# EAGLE schematic CosmicPiuTelescopeAlpha (EAGLE 8.3.1)

## Sheet 1 of 2
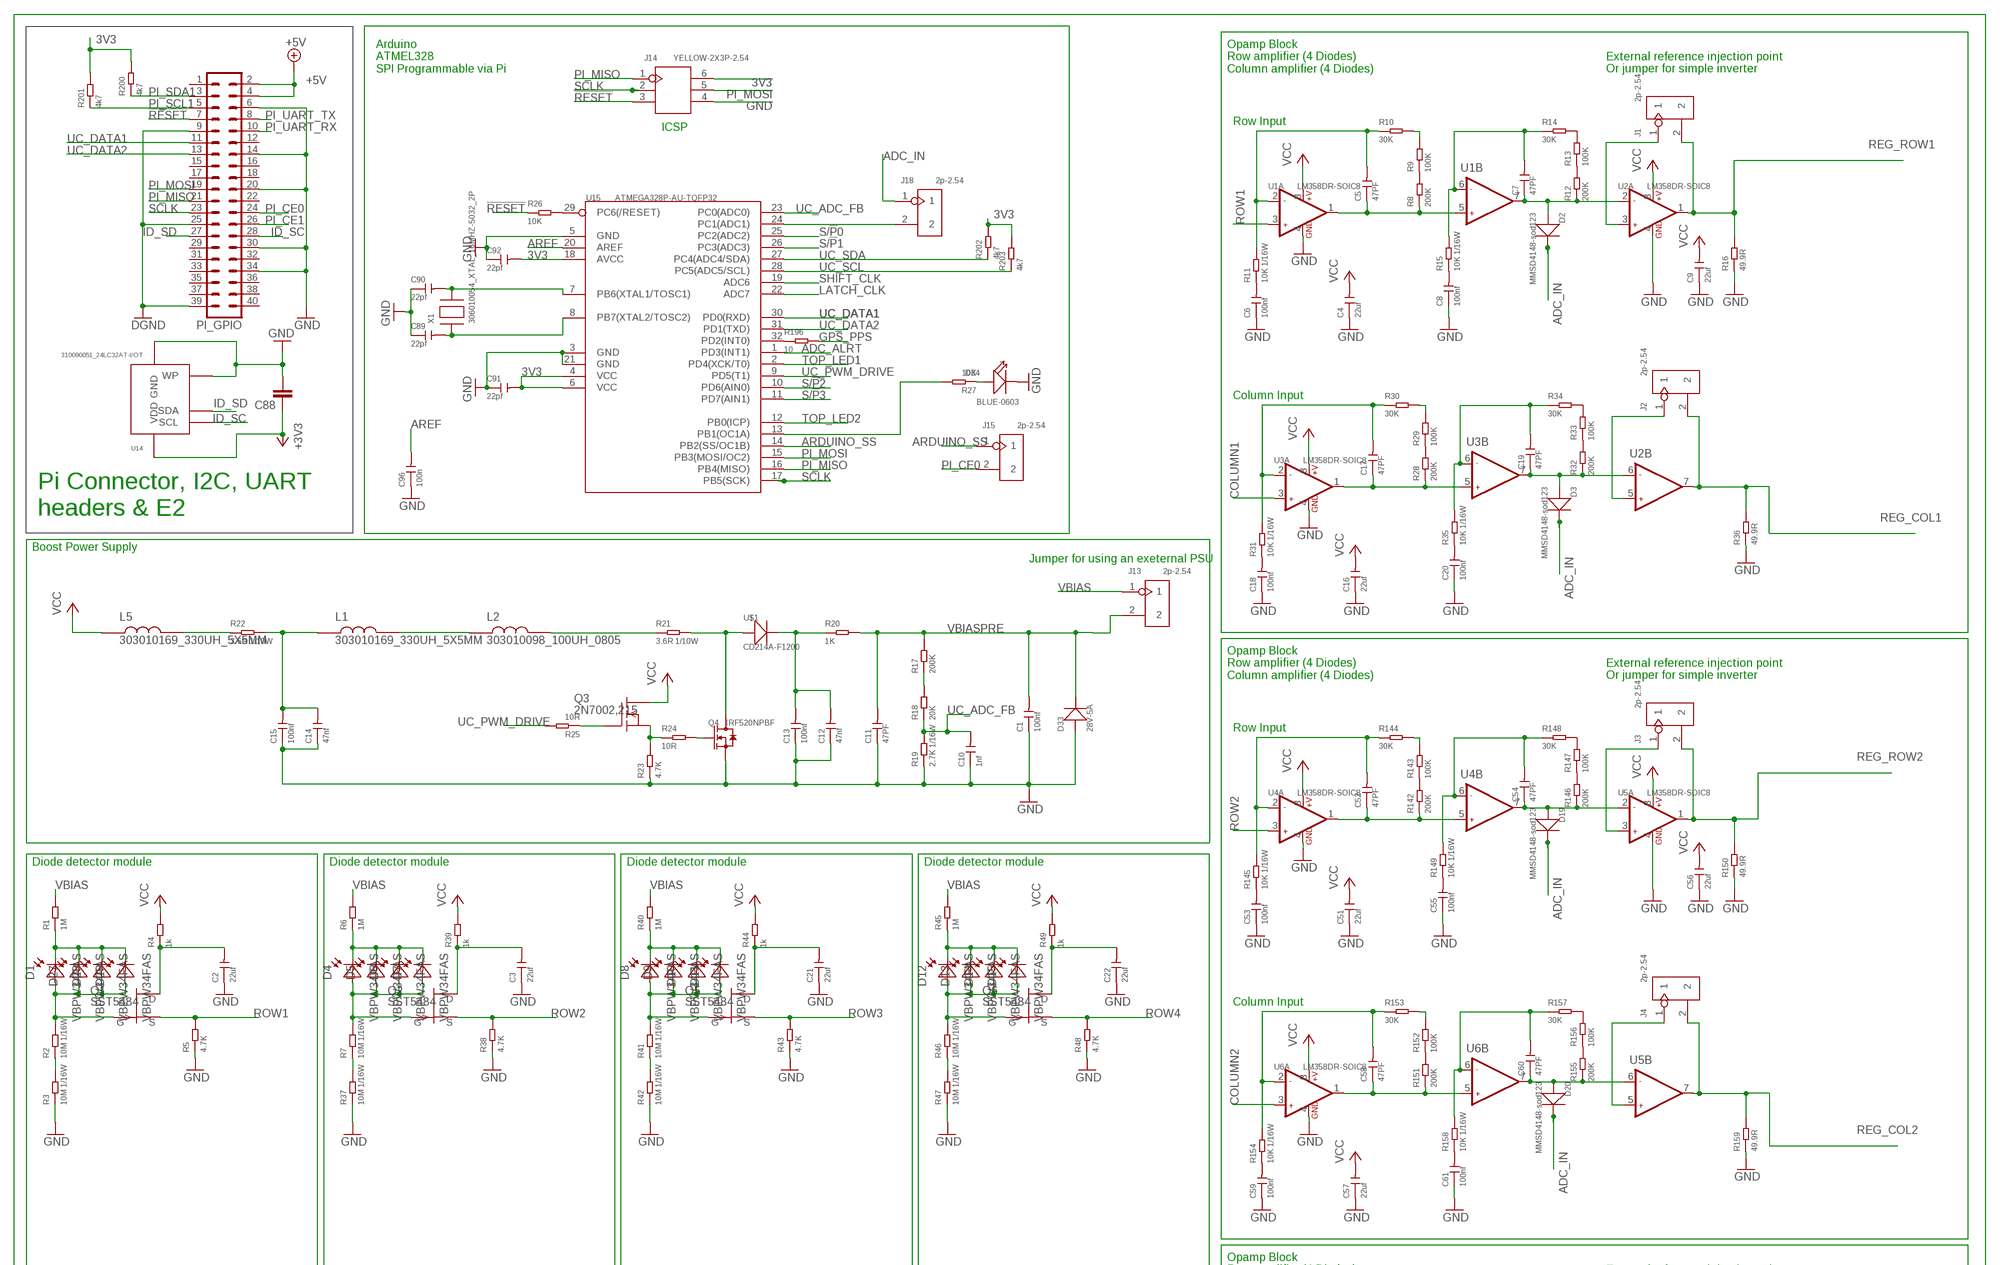
[diagram p0: schematic, sheet 1, part 1 of 2]
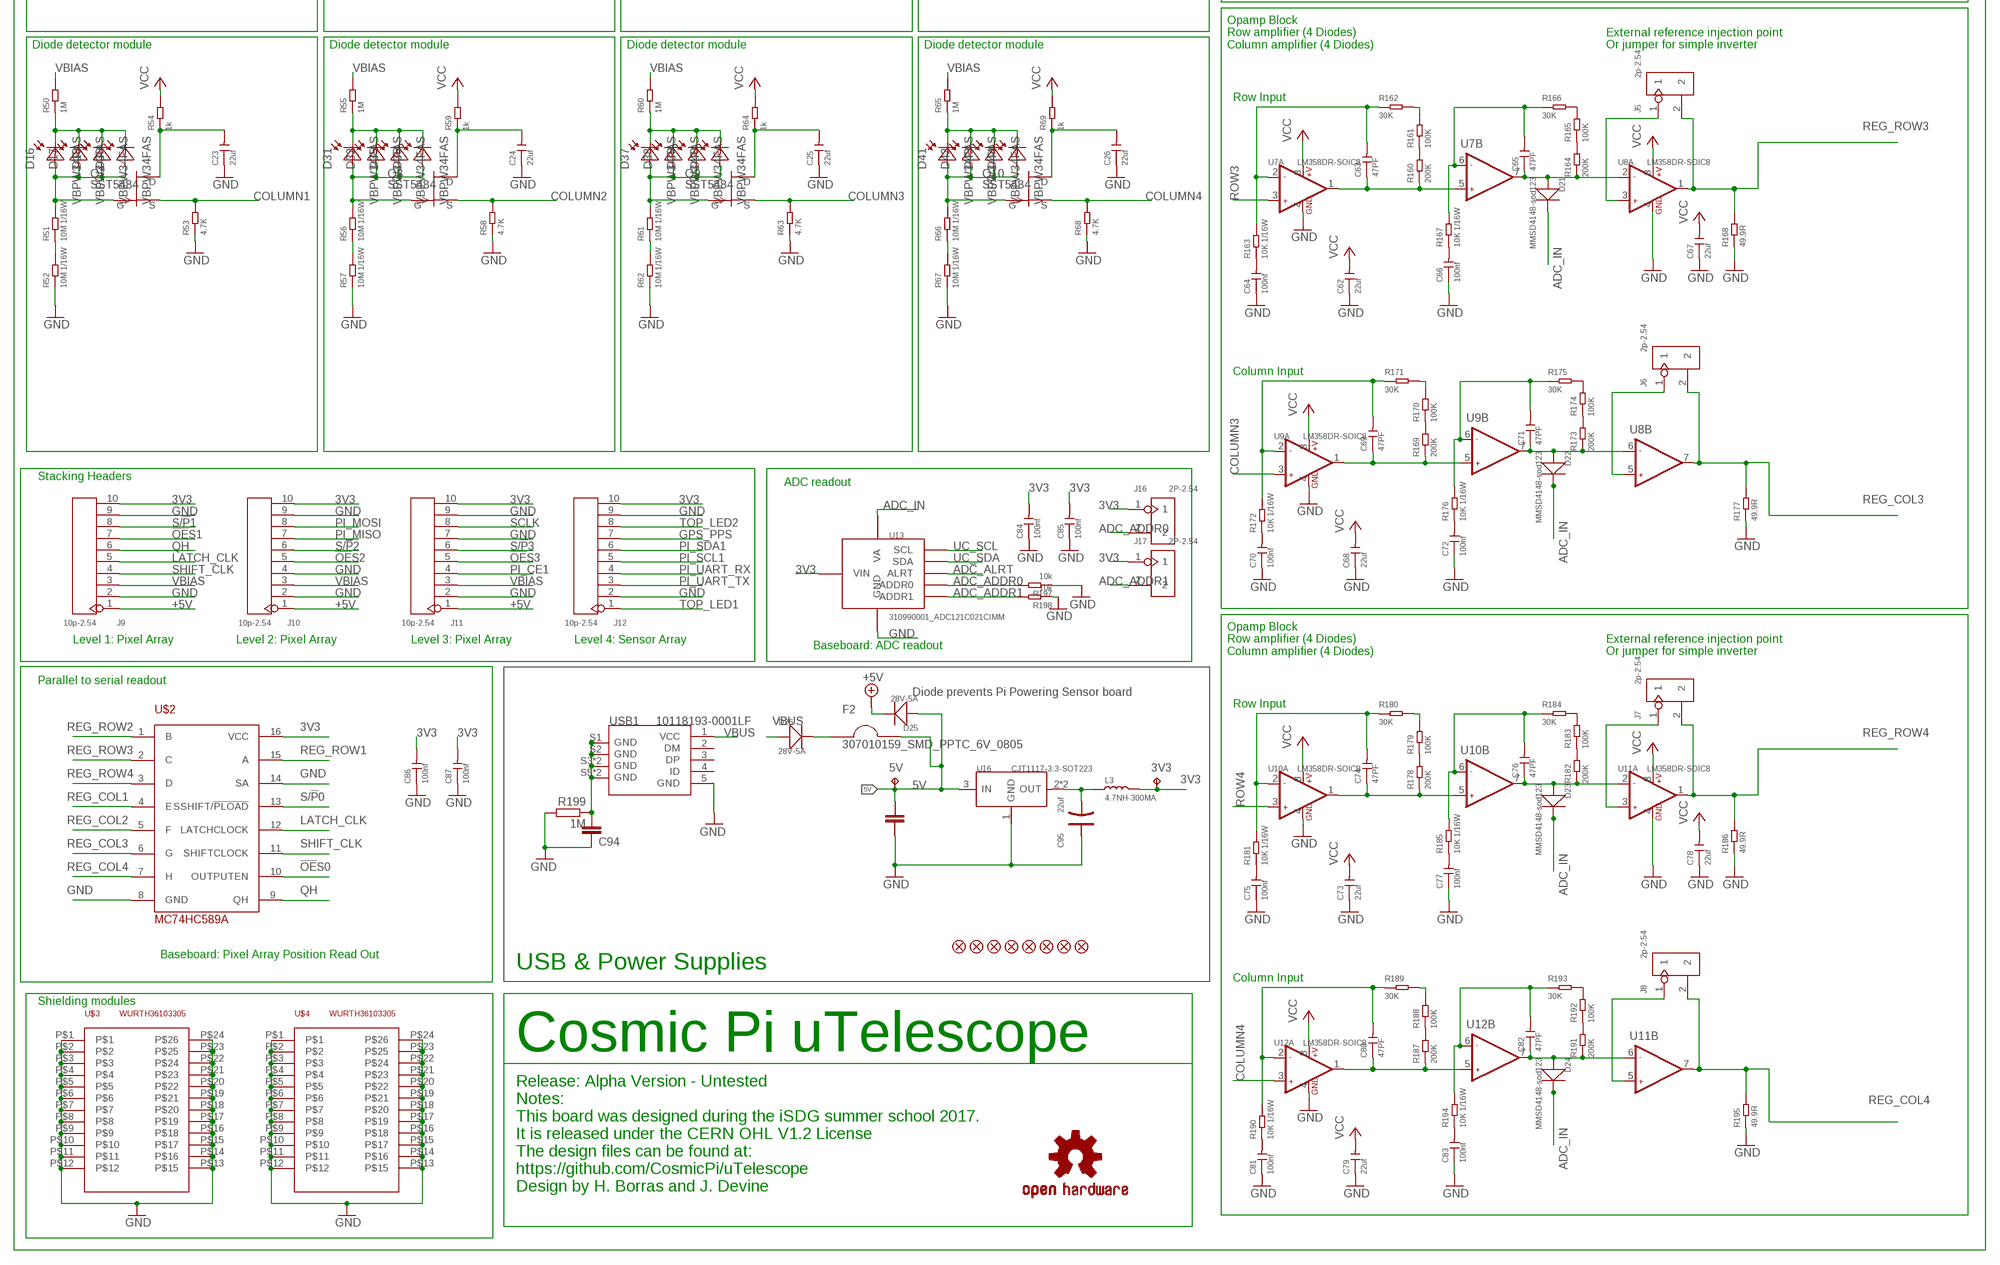
[diagram p1: schematic, sheet 1, part 2 of 2]

### Parts
3V3  TPB1,27  [B1,27]
5V  TPB1,27  [B1,27]
C1  100nf  CERAMIC-100NF-50V-10%-X7R(0603)  [C0603]
C2  22uf  CERAMIC-100UF-6.3V-20%-X5R(1206)  [C1206]
C3  22uf  CERAMIC-100UF-6.3V-20%-X5R(1206)  [C1206]
C4  22uf  CERAMIC-22UF-6.3V-20%-X5R(0805)  [C0805]
C5  47PF  CERAMIC-47PF-50V-5%-NP0(0402)  [C0402]
C6  100nf  CERAMIC-100NF-25V-10%-X7R(0402)  [C0402]
C7  47PF  CERAMIC-47PF-50V-5%-NP0(0402)  [C0402]
C8  100nf  CERAMIC-100NF-25V-10%-X7R(0402)  [C0402]
C9  22uf  CERAMIC-22UF-6.3V-20%-X5R(0805)  [C0805]
C10  1nf  CERAMIC-1NF-50V-5%-C0G(0603)  [C0603]
C11  47PF  CERAMIC-47PF-50V-5%-NP0(0402)  [C0402]
C12  47nf  CERAMIC-47NF-25V-10%-X7R(0402)  [C0402]
C13  100nf  CERAMIC-100NF-50V-10%-X7R(0603)  [C0603]
C14  47nf  CERAMIC-47NF-25V-10%-X7R(0402)  [C0402]
C15  100nf  CERAMIC-100NF-50V-10%-X7R(0603)  [C0603]
C16  22uf  CERAMIC-22UF-6.3V-20%-X5R(0805)  [C0805]
C17  47PF  CERAMIC-47PF-50V-5%-NP0(0402)  [C0402]
C18  100nf  CERAMIC-100NF-25V-10%-X7R(0402)  [C0402]
C19  47PF  CERAMIC-47PF-50V-5%-NP0(0402)  [C0402]
C20  100nf  CERAMIC-100NF-25V-10%-X7R(0402)  [C0402]
C21  22uf  CERAMIC-100UF-6.3V-20%-X5R(1206)  [C1206]
C22  22uf  CERAMIC-100UF-6.3V-20%-X5R(1206)  [C1206]
C23  22uf  CERAMIC-100UF-6.3V-20%-X5R(1206)  [C1206]
C24  22uf  CERAMIC-100UF-6.3V-20%-X5R(1206)  [C1206]
C25  22uf  CERAMIC-100UF-6.3V-20%-X5R(1206)  [C1206]
C26  22uf  CERAMIC-100UF-6.3V-20%-X5R(1206)  [C1206]
C51  22uf  CERAMIC-22UF-6.3V-20%-X5R(0805)  [C0805]
C52  47PF  CERAMIC-47PF-50V-5%-NP0(0402)  [C0402]
C53  100nf  CERAMIC-100NF-25V-10%-X7R(0402)  [C0402]
C54  47PF  CERAMIC-47PF-50V-5%-NP0(0402)  [C0402]
C55  100nf  CERAMIC-100NF-25V-10%-X7R(0402)  [C0402]
C56  22uf  CERAMIC-22UF-6.3V-20%-X5R(0805)  [C0805]
C57  22uf  CERAMIC-22UF-6.3V-20%-X5R(0805)  [C0805]
C58  47PF  CERAMIC-47PF-50V-5%-NP0(0402)  [C0402]
C59  100nf  CERAMIC-100NF-25V-10%-X7R(0402)  [C0402]
C60  47PF  CERAMIC-47PF-50V-5%-NP0(0402)  [C0402]
C61  100nf  CERAMIC-100NF-25V-10%-X7R(0402)  [C0402]
C62  22uf  CERAMIC-22UF-6.3V-20%-X5R(0805)  [C0805]
C63  47PF  CERAMIC-47PF-50V-5%-NP0(0402)  [C0402]
C64  100nf  CERAMIC-100NF-25V-10%-X7R(0402)  [C0402]
C65  47PF  CERAMIC-47PF-50V-5%-NP0(0402)  [C0402]
C66  100nf  CERAMIC-100NF-25V-10%-X7R(0402)  [C0402]
C67  22uf  CERAMIC-22UF-6.3V-20%-X5R(0805)  [C0805]
C68  22uf  CERAMIC-22UF-6.3V-20%-X5R(0805)  [C0805]
C69  47PF  CERAMIC-47PF-50V-5%-NP0(0402)  [C0402]
C70  100nf  CERAMIC-100NF-25V-10%-X7R(0402)  [C0402]
C71  47PF  CERAMIC-47PF-50V-5%-NP0(0402)  [C0402]
C72  100nf  CERAMIC-100NF-25V-10%-X7R(0402)  [C0402]
C73  22uf  CERAMIC-22UF-6.3V-20%-X5R(0805)  [C0805]
C74  47PF  CERAMIC-47PF-50V-5%-NP0(0402)  [C0402]
C75  100nf  CERAMIC-100NF-25V-10%-X7R(0402)  [C0402]
C76  47PF  CERAMIC-47PF-50V-5%-NP0(0402)  [C0402]
C77  100nf  CERAMIC-100NF-25V-10%-X7R(0402)  [C0402]
C78  22uf  CERAMIC-22UF-6.3V-20%-X5R(0805)  [C0805]
C79  22uf  CERAMIC-22UF-6.3V-20%-X5R(0805)  [C0805]
C80  47PF  CERAMIC-47PF-50V-5%-NP0(0402)  [C0402]
C81  100nf  CERAMIC-100NF-25V-10%-X7R(0402)  [C0402]
C82  47PF  CERAMIC-47PF-50V-5%-NP0(0402)  [C0402]
C83  100nf  CERAMIC-100NF-25V-10%-X7R(0402)  [C0402]
C84  100nf  CERAMIC-100UF-6.3V-20%-X5R(1206)  [C1206]
C85  100nf  CERAMIC-100UF-6.3V-20%-X5R(1206)  [C1206]
C86  100nf  CERAMIC-100UF-6.3V-20%-X5R(1206)  [C1206]
C87  100nf  CERAMIC-100UF-6.3V-20%-X5R(1206)  [C1206]
C88  C-EUC0402  [C0402]
C89  22pf  CERAMIC-22PF-50V-5%-NPO(0603)  [C0603]
C90  22pf  CERAMIC-22PF-50V-5%-NPO(0603)  [C0603]
C91  22pf  CERAMIC-22PF-50V-5%-NPO(0603)  [C0603]
C92  22pf  CERAMIC-22PF-50V-5%-NPO(0603)  [C0603]
C93  47uF  C_1206  [1206]
C94  C-EUC0402  [C0402]
C95  22uf  TANTALUM-SMD-22UF-10V-10%(AVX-B)  [AVX-B]
C96  100n  CERAMIC-22PF-50V-5%-NPO(0603)  [C0603]
D1  VBPW34FAS  [SOD6439X130N]
D2  MMSD4148-sod123  SMD-DIODE-100V-200MA(SOD-123)  [SOD-123]
D3  MMSD4148-sod123  SMD-DIODE-100V-200MA(SOD-123)  [SOD-123]
D4  VBPW34FAS  [SOD6439X130N]
D5  VBPW34FAS  [SOD6439X130N]
D6  VBPW34FAS  [SOD6439X130N]
D7  VBPW34FAS  [SOD6439X130N]
D8  VBPW34FAS  [SOD6439X130N]
D9  VBPW34FAS  [SOD6439X130N]
D10  VBPW34FAS  [SOD6439X130N]
D11  VBPW34FAS  [SOD6439X130N]
D12  VBPW34FAS  [SOD6439X130N]
D13  VBPW34FAS  [SOD6439X130N]
D14  VBPW34FAS  [SOD6439X130N]
D15  VBPW34FAS  [SOD6439X130N]
D16  VBPW34FAS  [SOD6439X130N]
D17  VBPW34FAS  [SOD6439X130N]
D18  VBPW34FAS  [SOD6439X130N]
D19  MMSD4148-sod123  SMD-DIODE-100V-200MA(SOD-123)  [SOD-123]
D20  MMSD4148-sod123  SMD-DIODE-100V-200MA(SOD-123)  [SOD-123]
D21  MMSD4148-sod123  SMD-DIODE-100V-200MA(SOD-123)  [SOD-123]
D22  MMSD4148-sod123  SMD-DIODE-100V-200MA(SOD-123)  [SOD-123]
D23  MMSD4148-sod123  SMD-DIODE-100V-200MA(SOD-123)  [SOD-123]
D24  MMSD4148-sod123  SMD-DIODE-100V-200MA(SOD-123)  [SOD-123]
D25  28V-5A  SMD-DIODE-SCHOTTKY-28V-5A(DO-214AA)  [DO-214AA]
D26  28V-5A  SMD-DIODE-SCHOTTKY-28V-5A(DO-214AA)  [DO-214AA]
D27  VBPW34FAS  [SOD6439X130N]
D28  VBPW34FAS  [SOD6439X130N]
D29  VBPW34FAS  [SOD6439X130N]
D30  VBPW34FAS  [SOD6439X130N]
D31  VBPW34FAS  [SOD6439X130N]
D32  VBPW34FAS  [SOD6439X130N]
D33  28V-5A  SMD-DIODE-SCHOTTKY-28V-5A(DO-214AA)  [DO-214AA]
D34  BLUE-0603  SMD-LED-CLEAR-BLUE(0603)  [LED-0603]
D35  VBPW34FAS  [SOD6439X130N]
D36  VBPW34FAS  [SOD6439X130N]
D37  VBPW34FAS  [SOD6439X130N]
D38  VBPW34FAS  [SOD6439X130N]
D39  VBPW34FAS  [SOD6439X130N]
D40  VBPW34FAS  [SOD6439X130N]
D41  VBPW34FAS  [SOD6439X130N]
D42  VBPW34FAS  [SOD6439X130N]
D43  VBPW34FAS  [SOD6439X130N]
D44  VBPW34FAS  [SOD6439X130N]
F2  307010159_SMD_PPTC_6V_0805  [F0805]
FD1  FIDUCIAL1X2  [FIDUCIAL-1X2]
FD2  FIDUCIAL1X2  [FIDUCIAL-1X2]
FD3  FIDUCIAL1X2  [FIDUCIAL-1X2]
FD4  FIDUCIAL1X2  [FIDUCIAL-1X2]
FD5  FIDUCIAL1X2  [FIDUCIAL-1X2]
FD6  FIDUCIAL1X2  [FIDUCIAL-1X2]
FD7  FIDUCIAL1X2  [FIDUCIAL-1X2]
FD8  FIDUCIAL1X2  [FIDUCIAL-1X2]
J1  2p-2.54  DIP-BLACK-MALE-HEADER-VERT(2P-2.54)  [H2-2.54]
J2  2p-2.54  DIP-BLACK-MALE-HEADER-VERT(2P-2.54)  [H2-2.54]
J3  2p-2.54  DIP-BLACK-MALE-HEADER-VERT(2P-2.54)  [H2-2.54]
J4  2p-2.54  DIP-BLACK-MALE-HEADER-VERT(2P-2.54)  [H2-2.54]
J5  2p-2.54  DIP-BLACK-MALE-HEADER-VERT(2P-2.54)  [H2-2.54]
J6  2p-2.54  DIP-BLACK-MALE-HEADER-VERT(2P-2.54)  [H2-2.54]
J7  2p-2.54  DIP-BLACK-MALE-HEADER-VERT(2P-2.54)  [H2-2.54]
J8  2p-2.54  DIP-BLACK-MALE-HEADER-VERT(2P-2.54)  [H2-2.54]
J9  10p-2.54  DIP-LONG-BLACK-FEMALE-HEADER-VERT(10P-2.54)  [H10-2.54]
J10  10p-2.54  DIP-LONG-BLACK-FEMALE-HEADER-VERT(10P-2.54)  [H10-2.54]
J11  10p-2.54  DIP-LONG-BLACK-FEMALE-HEADER-VERT(10P-2.54)  [H10-2.54]
J12  10p-2.54  DIP-LONG-BLACK-FEMALE-HEADER-VERT(10P-2.54)  [H10-2.54]
J13  2p-2.54  DIP-BLACK-MALE-HEADER-VERT(2P-2.54)  [H2-2.54]
J14  YELLOW-2X3P-2.54  DIP-YELLOW-MALE-HEADER-VERT(2X3P-2.54)  [H2X3-2.54]
J15  2p-2.54  DIP-BLACK-MALE-HEADER-VERT(2P-2.54)  [H2-2.54]
J16  2P-2.54  DIP-WHITE-MALE-HEADER-VERT(2P-2.54)  [H2-2.54]
J17  2P-2.54  DIP-WHITE-MALE-HEADER-VERT(2P-2.54)  [H2-2.54]
J18  2p-2.54  DIP-BLACK-MALE-HEADER-VERT(2P-2.54)  [H2-2.54]
L1  303010169_330UH_5X5MM  [L2018]
L2  303010098_100UH_0805  [L0805]
L3  4.7NH-300MA  SMD-INDUCTOR-4.7NH-0.3NH-300MA(0402)  [L0402]
L5  303010169_330UH_5X5MM  [L2018]
LOGO1  OSHW-LOGOL  [OSHW-LOGO-L]
PI_GPIO  MA20-2  [MA20-2]
Q1  SST5484  [SOT23]
Q2  SST5484  [SOT23]
Q3  2N7002,215  [SOT23]
Q4  IRF520NPBF  DIP-MOSFET-N-CH-100V-9.7A-IRF520NPBF(TO-220AB)  [TO-220]
Q5  SST5484  [SOT23]
Q6  SST5484  [SOT23]
Q7  SST5484  [SOT23]
Q8  SST5484  [SOT23]
Q9  SST5484  [SOT23]
Q10  SST5484  [SOT23]
R1  1M  SMD-RES-1M-1%-1/16W(0402)  [R0402]
R2  10M 1/16W  SMD-RES-10M-1%-1/16W(0402)  [R0402]
R3  10M 1/16W  SMD-RES-10M-1%-1/16W(0402)  [R0402]
R4  1k  SMD-RES-4.7K-5%-1/16W(0402)  [R0402]
R5  4.7K  SMD-RES-4.7K-5%-1/16W(0402)  [R0402]
R6  1M  SMD-RES-1M-1%-1/16W(0402)  [R0402]
R7  10M 1/16W  SMD-RES-10M-1%-1/16W(0402)  [R0402]
R8  200K  SMD-RES-200K-5%-1/10W(0603)  [R0603]
R9  100K  SMD-RES-100K-1%-1/16W(0402)  [R0402]
R10  30K  SMD-RES-30K-1%-1/10W(0603)  [R0603]
R11  10K 1/16W  SMD-RES-10K-1%-1/16W(0402)  [R0402]
R12  200K  SMD-RES-200K-5%-1/10W(0603)  [R0603]
R13  100K  SMD-RES-100K-1%-1/16W(0402)  [R0402]
R14  30K  SMD-RES-30K-1%-1/10W(0603)  [R0603]
R15  10K 1/16W  SMD-RES-10K-1%-1/16W(0402)  [R0402]
R16  49.9R  SMD-RES-49.9R-1%-1/16W(0402)  [R0402]
R17  200K  SMD-RES-200K-5%-1/10W(0603)  [R0603]
R18  20K  SMD-RES-20K-1%-1/10W(0603)  [R0603]
R19  2.7K 1/16W  SMD-RES-2.7K-1%-1/16W(0402)  [R0402]
R20  1K  SMD-RES-1K-1%-1/10W(0603)  [R0603]
R21  3.6R 1/10W  SMD-RES-3.6R-5%-1/10W(0603)  [R0603]
R22  3.6R 1/10W  SMD-RES-3.6R-5%-1/10W(0603)  [R0603]
R23  4.7K  SMD-RES-4.7K-5%-1/8W(0805)  [R0805]
R24  10R  SMD-RES-10R-1%-1/10W(0603)  [R0603]
R25  10R  SMD-RES-10R-1%-1/10W(0603)  [R0603]
R26  10K  SMD-RES-10K-1%-1/10W(0603)  [R0603]
R27  10K  SMD-RES-10K-1%-1/10W(0603)  [R0603]
R28  200K  SMD-RES-200K-5%-1/10W(0603)  [R0603]
R29  100K  SMD-RES-100K-1%-1/16W(0402)  [R0402]
R30  30K  SMD-RES-30K-1%-1/10W(0603)  [R0603]
R31  10K 1/16W  SMD-RES-10K-1%-1/16W(0402)  [R0402]
R32  200K  SMD-RES-200K-5%-1/10W(0603)  [R0603]
R33  100K  SMD-RES-100K-1%-1/16W(0402)  [R0402]
R34  30K  SMD-RES-30K-1%-1/10W(0603)  [R0603]
R35  10K 1/16W  SMD-RES-10K-1%-1/16W(0402)  [R0402]
R36  49.9R  SMD-RES-49.9R-1%-1/16W(0402)  [R0402]
R37  10M 1/16W  SMD-RES-10M-1%-1/16W(0402)  [R0402]
R38  4.7K  SMD-RES-4.7K-5%-1/16W(0402)  [R0402]
R39  1k  SMD-RES-4.7K-5%-1/16W(0402)  [R0402]
R40  1M  SMD-RES-1M-1%-1/16W(0402)  [R0402]
R41  10M 1/16W  SMD-RES-10M-1%-1/16W(0402)  [R0402]
R42  10M 1/16W  SMD-RES-10M-1%-1/16W(0402)  [R0402]
R43  4.7K  SMD-RES-4.7K-5%-1/16W(0402)  [R0402]
R44  1k  SMD-RES-4.7K-5%-1/16W(0402)  [R0402]
R45  1M  SMD-RES-1M-1%-1/16W(0402)  [R0402]
R46  10M 1/16W  SMD-RES-10M-1%-1/16W(0402)  [R0402]
R47  10M 1/16W  SMD-RES-10M-1%-1/16W(0402)  [R0402]
R48  4.7K  SMD-RES-4.7K-5%-1/16W(0402)  [R0402]
R49  1k  SMD-RES-4.7K-5%-1/16W(0402)  [R0402]
R50  1M  SMD-RES-1M-1%-1/16W(0402)  [R0402]
R51  10M 1/16W  SMD-RES-10M-1%-1/16W(0402)  [R0402]
R52  10M 1/16W  SMD-RES-10M-1%-1/16W(0402)  [R0402]
R53  4.7K  SMD-RES-4.7K-5%-1/16W(0402)  [R0402]
R54  1k  SMD-RES-4.7K-5%-1/16W(0402)  [R0402]
R55  1M  SMD-RES-1M-1%-1/16W(0402)  [R0402]
R56  10M 1/16W  SMD-RES-10M-1%-1/16W(0402)  [R0402]
R57  10M 1/16W  SMD-RES-10M-1%-1/16W(0402)  [R0402]
R58  4.7K  SMD-RES-4.7K-5%-1/16W(0402)  [R0402]
R59  1k  SMD-RES-4.7K-5%-1/16W(0402)  [R0402]
R60  1M  SMD-RES-1M-1%-1/16W(0402)  [R0402]
R61  10M 1/16W  SMD-RES-10M-1%-1/16W(0402)  [R0402]
R62  10M 1/16W  SMD-RES-10M-1%-1/16W(0402)  [R0402]
R63  4.7K  SMD-RES-4.7K-5%-1/16W(0402)  [R0402]
R64  1k  SMD-RES-4.7K-5%-1/16W(0402)  [R0402]
R65  1M  SMD-RES-1M-1%-1/16W(0402)  [R0402]
R66  10M 1/16W  SMD-RES-10M-1%-1/16W(0402)  [R0402]
R67  10M 1/16W  SMD-RES-10M-1%-1/16W(0402)  [R0402]
R68  4.7K  SMD-RES-4.7K-5%-1/16W(0402)  [R0402]
R69  1k  SMD-RES-4.7K-5%-1/16W(0402)  [R0402]
R142  200K  SMD-RES-200K-5%-1/10W(0603)  [R0603]
R143  100K  SMD-RES-100K-1%-1/16W(0402)  [R0402]
R144  30K  SMD-RES-30K-1%-1/10W(0603)  [R0603]
R145  10K 1/16W  SMD-RES-10K-1%-1/16W(0402)  [R0402]
R146  200K  SMD-RES-200K-5%-1/10W(0603)  [R0603]
R147  100K  SMD-RES-100K-1%-1/16W(0402)  [R0402]
R148  30K  SMD-RES-30K-1%-1/10W(0603)  [R0603]
R149  10K 1/16W  SMD-RES-10K-1%-1/16W(0402)  [R0402]
R150  49.9R  SMD-RES-49.9R-1%-1/16W(0402)  [R0402]
R151  200K  SMD-RES-200K-5%-1/10W(0603)  [R0603]
R152  100K  SMD-RES-100K-1%-1/16W(0402)  [R0402]
R153  30K  SMD-RES-30K-1%-1/10W(0603)  [R0603]
R154  10K 1/16W  SMD-RES-10K-1%-1/16W(0402)  [R0402]
R155  200K  SMD-RES-200K-5%-1/10W(0603)  [R0603]
R156  100K  SMD-RES-100K-1%-1/16W(0402)  [R0402]
R157  30K  SMD-RES-30K-1%-1/10W(0603)  [R0603]
R158  10K 1/16W  SMD-RES-10K-1%-1/16W(0402)  [R0402]
R159  49.9R  SMD-RES-49.9R-1%-1/16W(0402)  [R0402]
R160  200K  SMD-RES-200K-5%-1/10W(0603)  [R0603]
R161  100K  SMD-RES-100K-1%-1/16W(0402)  [R0402]
R162  30K  SMD-RES-30K-1%-1/10W(0603)  [R0603]
R163  10K 1/16W  SMD-RES-10K-1%-1/16W(0402)  [R0402]
R164  200K  SMD-RES-200K-5%-1/10W(0603)  [R0603]
R165  100K  SMD-RES-100K-1%-1/16W(0402)  [R0402]
R166  30K  SMD-RES-30K-1%-1/10W(0603)  [R0603]
R167  10K 1/16W  SMD-RES-10K-1%-1/16W(0402)  [R0402]
R168  49.9R  SMD-RES-49.9R-1%-1/16W(0402)  [R0402]
R169  200K  SMD-RES-200K-5%-1/10W(0603)  [R0603]
R170  100K  SMD-RES-100K-1%-1/16W(0402)  [R0402]
R171  30K  SMD-RES-30K-1%-1/10W(0603)  [R0603]
R172  10K 1/16W  SMD-RES-10K-1%-1/16W(0402)  [R0402]
R173  200K  SMD-RES-200K-5%-1/10W(0603)  [R0603]
R174  100K  SMD-RES-100K-1%-1/16W(0402)  [R0402]
R175  30K  SMD-RES-30K-1%-1/10W(0603)  [R0603]
R176  10K 1/16W  SMD-RES-10K-1%-1/16W(0402)  [R0402]
R177  49.9R  SMD-RES-49.9R-1%-1/16W(0402)  [R0402]
R178  200K  SMD-RES-200K-5%-1/10W(0603)  [R0603]
R179  100K  SMD-RES-100K-1%-1/16W(0402)  [R0402]
R180  30K  SMD-RES-30K-1%-1/10W(0603)  [R0603]
R181  10K 1/16W  SMD-RES-10K-1%-1/16W(0402)  [R0402]
R182  200K  SMD-RES-200K-5%-1/10W(0603)  [R0603]
R183  100K  SMD-RES-100K-1%-1/16W(0402)  [R0402]
R184  30K  SMD-RES-30K-1%-1/10W(0603)  [R0603]
R185  10K 1/16W  SMD-RES-10K-1%-1/16W(0402)  [R0402]
R186  49.9R  SMD-RES-49.9R-1%-1/16W(0402)  [R0402]
R187  200K  SMD-RES-200K-5%-1/10W(0603)  [R0603]
R188  100K  SMD-RES-100K-1%-1/16W(0402)  [R0402]
R189  30K  SMD-RES-30K-1%-1/10W(0603)  [R0603]
R190  10K 1/16W  SMD-RES-10K-1%-1/16W(0402)  [R0402]
R191  200K  SMD-RES-200K-5%-1/10W(0603)  [R0603]
R192  100K  SMD-RES-100K-1%-1/16W(0402)  [R0402]
R193  30K  SMD-RES-30K-1%-1/10W(0603)  [R0603]
R194  10K 1/16W  SMD-RES-10K-1%-1/16W(0402)  [R0402]
R195  49.9R  SMD-RES-49.9R-1%-1/16W(0402)  [R0402]
R196  10  SMD-RES-10K-1%-1/10W(0603)  [R0603]
R197  10k  SMD-RES-4.7K-5%-1/16W(0402)  [R0402]
R198  10k  SMD-RES-4.7K-5%-1/16W(0402)  [R0402]
R199  1M  R-EU_R0402  [R0402]
R200  4k7  SMD-RES-10K-1%-1/10W(0603)  [R0603]
R201  4k7  SMD-RES-10K-1%-1/10W(0603)  [R0603]
R202  4k7  SMD-RES-10K-1%-1/10W(0603)  [R0603]
R203  4k7  SMD-RES-10K-1%-1/10W(0603)  [R0603]
U1  LM358DR-SOIC8  AMPLIFIER-LM358DR(SOIC8)  [SOIC8-1.27-5X4MM]
U2  LM358DR-SOIC8  AMPLIFIER-LM358DR(SOIC8)  [SOIC8-1.27-5X4MM]
U3  LM358DR-SOIC8  AMPLIFIER-LM358DR(SOIC8)  [SOIC8-1.27-5X4MM]
U4  LM358DR-SOIC8  AMPLIFIER-LM358DR(SOIC8)  [SOIC8-1.27-5X4MM]
U5  LM358DR-SOIC8  AMPLIFIER-LM358DR(SOIC8)  [SOIC8-1.27-5X4MM]
U6  LM358DR-SOIC8  AMPLIFIER-LM358DR(SOIC8)  [SOIC8-1.27-5X4MM]
U7  LM358DR-SOIC8  AMPLIFIER-LM358DR(SOIC8)  [SOIC8-1.27-5X4MM]
U8  LM358DR-SOIC8  AMPLIFIER-LM358DR(SOIC8)  [SOIC8-1.27-5X4MM]
U9  LM358DR-SOIC8  AMPLIFIER-LM358DR(SOIC8)  [SOIC8-1.27-5X4MM]
U10  LM358DR-SOIC8  AMPLIFIER-LM358DR(SOIC8)  [SOIC8-1.27-5X4MM]
U11  LM358DR-SOIC8  AMPLIFIER-LM358DR(SOIC8)  [SOIC8-1.27-5X4MM]
U12  LM358DR-SOIC8  AMPLIFIER-LM358DR(SOIC8)  [SOIC8-1.27-5X4MM]
U13  310990001_ADC121C021CIMM  [VSSOP8]
U14  310090051_24LC32AT-I/OT  [SOT235]
U15  ATMEGA328P-AU-TQFP32  MCU-ATMEGA328P-AU(TQFP32)  [TQFP32-0.8-7X7MM]
U16  CJT1117-3.3-SOT223  PMIC-CJT1117-3.3(SOT223)  [SOT-223]
U$1  CD214A-F1200  [DIOM8059X265N]
U$2  MC74HC589A  [SOIC127P600X175-16N]
U$3  WURTH36103305  [36103305]
U$4  WURTH36103305  [36103305]
USB1  10118193-0001LF  MICRO-USB-SMD-B-(10118193-0001LF)  [MICRO-USB5+6P-SMD-0.65-B]
X1  306010054_XTAL_16MHZ-5032_2P  [X5032_2P]

### Nets
3V3: 3V3.TP C84.2 C85.2 C86.2 C87.2 C88.1 C91.2 C92.2 J9.10 J10.10 J11.10 J12.10 J14.6 J16.1 J17.1 L3.2 R200.2 R201.2 R202.2 R203.2 U13.P$4(VIN) U14.4(VDD) U15.4(VCC) U15.6(VCC) U15.18(AVCC) U$2.16(VCC) ; supply symbol labelled +3V3
5V: 5V.TP C93.1 D25.+ F2.P$2 U16.3(IN)
!OE!S0: U$2.10(OUTPUTEN)
!OE!S1: J9.7
!OE!S2: J10.5
!OE!S3: J11.5
!RESET: J14.3 PI_GPIO.7 R26.1
+5V [Power]: C4.2 C9.2 C16.2 C51.2 C56.2 C57.2 C62.2 C67.2 C68.2 C73.2 C78.2 C79.2 D25.- J9.1 J10.1 J11.1 L5.P$1 PI_GPIO.2 PI_GPIO.4 Q3.3(D) R4.2 R39.2 R44.2 R49.2 R54.2 R59.2 R64.2 R69.2 U1.8(A:+V) U2.8(A:+V) U3.8(A:+V) U4.8(A:+V) U5.8(A:+V) U6.8(A:+V) U7.8(A:+V) U8.8(A:+V) U9.8(A:+V) U10.8(A:+V) U11.8(A:+V) U12.8(A:+V) ; supply symbol labelled VCC
ADC_ADDR0: J16.2 R197.2 U13.P$3(ADDR0)
ADC_ADDR1: J17.2 R198.2 U13.P$6(ADDR1)
ADC_ALRT: U13.P$2(ALRT) U15.1(PD3(INT1))
ADC_IN: D2.- D3.- D19.- D20.- D21.- D22.- D23.- D24.- J18.1 U13.P$5(VA)
ARDUINO_SS: J15.1 U15.14(PB2(SS/OC1B))
AREF: C96.2 U15.20(AREF)
COLUMN1: Q7.2(S) R53.2 U3.3(A:+IN1)
COLUMN2: Q8.2(S) R58.2 U6.3(A:+IN1)
COLUMN3: Q9.2(S) R63.2 U9.3(A:+IN1)
COLUMN4: Q10.2(S) R68.2 U12.3(A:+IN1)
GND [PowerGND]: C1.1 C2.1 C3.1 C4.1 C6.1 C8.1 C9.1 C10.1 C11.1 C12.1 C13.1 C14.1 C15.1 C16.1 C18.1 C20.1 C21.1 C22.1 C23.1 C24.1 C25.1 C26.1 C51.1 C53.1 C55.1 C56.1 C57.1 C59.1 C61.1 C62.1 C64.1 C66.1 C67.1 C68.1 C70.1 C72.1 C73.1 C75.1 C77.1 C78.1 C79.1 C81.1 C83.1 C84.1 C85.1 C86.1 C87.1 C88.2 C89.1 C90.1 C91.1 C92.1 C93.2 C94.1 C95.+ C96.1 D33.+ D34.- J9.2 J9.9 J10.2 J10.4 J10.9 J11.2 J11.7 J11.9 J12.2 J12.9 J14.4 PI_GPIO.6 PI_GPIO.9 PI_GPIO.14 PI_GPIO.20 PI_GPIO.25 PI_GPIO.30 PI_GPIO.34 PI_GPIO.39 Q4.2(S) Q4.HEAT(S) R3.1 R5.1 R16.1 R19.1 R23.1 R36.1 R37.1 R38.1 R42.1 R43.1 R47.1 R48.1 R52.1 R53.1 R57.1 R58.1 R62.1 R63.1 R67.1 R68.1 R150.1 R159.1 R168.1 R177.1 R186.1 R195.1 R197.1 R198.1 R199.2 U1.4(A:GND) U2.4(A:GND) U3.4(A:GND) U4.4(A:GND) U5.4(A:GND) U6.4(A:GND) U7.4(A:GND) U8.4(A:GND) U9.4(A:GND) U10.4(A:GND) U11.4(A:GND) U12.4(A:GND) U13.P$7(GND) U14.2(GND) U14.5(WP) U15.3(GND) U15.5(GND) U15.21(GND) U16.1(GND) U$2.8(GND) U$2.14(SA) U$3.P$1 U$3.P$2 U$3.P$3 U$3.P$4 U$3.P$5 U$3.P$6 U$3.P$7 U$3.P$8 U$3.P$9 U$3.P$10 U$3.P$11 U$3.P$12 U$3.P$13 U$3.P$14 U$3.P$15 U$3.P$16 U$3.P$17 U$3.P$18 U$3.P$19 U$3.P$20 U$3.P$21 U$3.P$22 U$3.P$23 U$3.P$24 U$4.P$1 U$4.P$2 U$4.P$3 U$4.P$4 U$4.P$5 U$4.P$6 U$4.P$7 U$4.P$8 U$4.P$9 U$4.P$10 U$4.P$11 U$4.P$12 U$4.P$13 U$4.P$14 U$4.P$15 U$4.P$16 U$4.P$17 U$4.P$18 U$4.P$19 U$4.P$20 U$4.P$21 U$4.P$22 U$4.P$23 U$4.P$24 USB1.5(GND) ; supply symbol labelled DGND
GPS_PPS: J12.7 R196.2
ID_SC: PI_GPIO.28 U14.1(SCL)
ID_SD: PI_GPIO.27 U14.3(SDA)
LATCH_CLK: J9.5 U15.22(ADC7) U$2.12(LATCHCLOCK)
N$1 [Power]: Q4.3(D) R21.2 U$1.1(+)
N$2: D1.C D27.C D28.C D29.C R1.1
N$3: D1.A D27.A D28.A D29.A Q1.3(G) R2.2
N$4: R2.1 R3.2
N$5: C2.2 Q1.1(D) R4.1
N$6: R28.2 R29.1
N$7: C18.2 R31.1
N$8: D4.C D5.C D6.C D7.C R6.1
N$9: R8.2 R9.1
N$10: C6.2 R11.1
N$11: C5.1 R8.1 U1.1(A:OUT1) U1.5(B:+IN2)
N$12: R9.2 R10.2
N$13: C5.2 R10.1 R11.2 U1.2(A:-IN1)
N$14: R12.2 R13.1
N$15: C8.2 R15.1
N$16: R13.2 R14.2
N$17: C7.2 R14.1 R15.2 U1.6(B:-IN2)
N$18: D4.A D5.A D6.A D7.A Q2.3(G) R7.2
N$19: R7.1 R37.2
N$20: C7.1 D2.+ R12.1 U1.7(B:OUT2) U2.2(A:-IN1)
N$21: J1.1 U2.3(A:+IN1)
N$22: R17.1 R18.2
N$23 [Power]: C14.2 C15.2 L1.P$1 R22.2
N$24 [Power]: C12.2 C13.2 R20.1 U$1.2(-)
N$25 [Power]: L5.P$2 R22.1
N$27 [Power]: L2.P$2 R21.1
N$28 [PowerGND]: Q3.2(S) R23.2 R24.1
N$29: Q3.1(G) R25.1
N$30 [Power]: L1.P$2 L2.P$1
N$31 [PowerGND]: Q4.1(G) R24.2
N$33: C17.1 R28.1 U3.1(A:OUT1) U3.5(B:+IN2)
N$34: R29.2 R30.2
N$35: C17.2 R30.1 R31.2 U3.2(A:-IN1)
N$36: R32.2 R33.1
N$37: C20.2 R35.1
N$38: R33.2 R34.2
N$39: C19.2 R34.1 R35.2 U3.6(B:-IN2)
N$40: C19.1 D3.+ R32.1 U2.6(B:-IN2) U3.7(B:OUT2)
N$41: C3.2 Q2.1(D) R39.1
N$42: J2.1 U2.5(B:+IN2)
N$47: D8.C D9.C D10.C D11.C R40.1
N$48: D8.A D9.A D10.A D11.A Q5.3(G) R41.2
N$49: R41.1 R42.2
N$50: C21.2 Q5.1(D) R44.1
N$52: D12.C D13.C D14.C D15.C R45.1
N$53: D12.A D13.A D14.A D15.A Q6.3(G) R46.2
N$54: R46.1 R47.2
N$55: C22.2 Q6.1(D) R49.1
N$57: D16.C D17.C D18.C D30.C R50.1
N$58: D16.A D17.A D18.A D30.A Q7.3(G) R51.2
N$59: R51.1 R52.2
N$60: C23.2 Q7.1(D) R54.1
N$62: D31.C D32.C D35.C D36.C R55.1
N$63: D31.A D32.A D35.A D36.A Q8.3(G) R56.2
N$64: R56.1 R57.2
N$65: C24.2 Q8.1(D) R59.1
N$67: D37.C D38.C D39.C D40.C R60.1
N$68: D37.A D38.A D39.A D40.A Q9.3(G) R61.2
N$69: R61.1 R62.2
N$70: C25.2 Q9.1(D) R64.1
N$72: D41.C D42.C D43.C D44.C R65.1
N$73: D41.A D42.A D43.A D44.A Q10.3(G) R66.2
N$74: R66.1 R67.2
N$75: C26.2 Q10.1(D) R69.1
N$137: R142.2 R143.1
N$138: C53.2 R145.1
N$139: C52.1 R142.1 U4.1(A:OUT1) U4.5(B:+IN2)
N$140: R143.2 R144.2
N$141: C52.2 R144.1 R145.2 U4.2(A:-IN1)
N$142: R146.2 R147.1
N$143: C55.2 R149.1
N$144: R147.2 R148.2
N$145: C54.2 R148.1 R149.2 U4.6(B:-IN2)
N$147: C54.1 D19.+ R146.1 U4.7(B:OUT2) U5.2(A:-IN1)
N$149: J3.1 U5.3(A:+IN1)
N$150: R151.2 R152.1
N$151: C59.2 R154.1
N$152: C58.1 R151.1 U6.1(A:OUT1) U6.5(B:+IN2)
N$153: R152.2 R153.2
N$154: C58.2 R153.1 R154.2 U6.2(A:-IN1)
N$155: R155.2 R156.1
N$156: C61.2 R158.1
N$157: R156.2 R157.2
N$158: C60.2 R157.1 R158.2 U6.6(B:-IN2)
N$159: C60.1 D20.+ R155.1 U5.6(B:-IN2) U6.7(B:OUT2)
N$161: J4.1 U5.5(B:+IN2)
N$163: C94.2 R199.1 USB1.S1(GND) USB1.S2(GND) USB1.S3(GND) USB1.S4(GND) USB1.S5(GND) USB1.S6(GND)
N$165: R160.2 R161.1
N$166: C64.2 R163.1
N$167: C63.1 R160.1 U7.1(A:OUT1) U7.5(B:+IN2)
N$168: R161.2 R162.2
N$169: C63.2 R162.1 R163.2 U7.2(A:-IN1)
N$170: R164.2 R165.1
N$171: C66.2 R167.1
N$172: R165.2 R166.2
N$173: C65.2 R166.1 R167.2 U7.6(B:-IN2)
N$175: C65.1 D21.+ R164.1 U7.7(B:OUT2) U8.2(A:-IN1)
N$176: D26.- F2.P$1
N$177: J5.1 U8.3(A:+IN1)
N$178: R169.2 R170.1
N$179: C70.2 R172.1
N$180: C69.1 R169.1 U9.1(A:OUT1) U9.5(B:+IN2)
N$181: R170.2 R171.2
N$182: C69.2 R171.1 R172.2 U9.2(A:-IN1)
N$183: R173.2 R174.1
N$184: C72.2 R176.1
N$185: R174.2 R175.2
N$186: C71.2 R175.1 R176.2 U9.6(B:-IN2)
N$187: C71.1 D22.+ R173.1 U8.6(B:-IN2) U9.7(B:OUT2)
N$189: J6.1 U8.5(B:+IN2)
N$191: C95.- L3.1 U16.2(OUT) U16.TER(OUT)
N$193: R178.2 R179.1
N$194: C75.2 R181.1
N$195: C74.1 R178.1 U10.1(A:OUT1) U10.5(B:+IN2)
N$196: R179.2 R180.2
N$197: C74.2 R180.1 R181.2 U10.2(A:-IN1)
N$198: R182.2 R183.1
N$199: C77.2 R185.1
N$200: R183.2 R184.2
N$201: C76.2 R184.1 R185.2 U10.6(B:-IN2)
N$203: C76.1 D23.+ R182.1 U10.7(B:OUT2) U11.2(A:-IN1)
N$204: R27.2 U15.13(PB1(OC1A))
N$205: J7.1 U11.3(A:+IN1)
N$206: R187.2 R188.1
N$207: C81.2 R190.1
N$208: C80.1 R187.1 U12.1(A:OUT1) U12.5(B:+IN2)
N$209: R188.2 R189.2
N$210: C80.2 R189.1 R190.2 U12.2(A:-IN1)
N$211: R191.2 R192.1
N$212: C83.2 R194.1
N$213: R192.2 R193.2
N$214: C82.2 R193.1 R194.2 U12.6(B:-IN2)
N$215: C82.1 D24.+ R191.1 U11.6(B:-IN2) U12.7(B:OUT2)
N$217: J8.1 U11.5(B:+IN2)
N$219: J18.2 U15.24(PC1(ADC1))
N$223: R26.2 U15.29(PC6(/RESET))
N$224: D34.+ R27.1
N$226: C90.2 U15.7(PB6(XTAL1/TOSC1)) X1.P$2
N$227: C89.2 U15.8(PB7(XTAL2/TOSC2)) X1.P$1
N$229: R196.1 U15.32(PD2(INT0))
PI_CE0: J15.2 PI_GPIO.24
PI_CE1: J11.4 PI_GPIO.26
PI_MISO: J10.7 J14.1 PI_GPIO.21 U15.16(PB4(MISO))
PI_MOSI: J10.8 J14.5 PI_GPIO.19 U15.15(PB3(MOSI/OC2))
PI_SCL1: J12.5 PI_GPIO.5 R201.1
PI_SDA1: J12.6 PI_GPIO.3 R200.1
PI_UART_RX: J12.4 PI_GPIO.10
PI_UART_TX: J12.3 PI_GPIO.8
QH: J9.6 U$2.9(QH)
REG_COL1: J2.2 R36.2 U2.7(B:OUT2) U$2.4(E)
REG_COL2: J4.2 R159.2 U5.7(B:OUT2) U$2.5(F)
REG_COL3: J6.2 R177.2 U8.7(B:OUT2) U$2.6(G)
REG_COL4: J8.2 R195.2 U11.7(B:OUT2) U$2.7(H)
REG_ROW1: J1.2 R16.2 U2.1(A:OUT1) U$2.15(A)
REG_ROW2: J3.2 R150.2 U5.1(A:OUT1) U$2.1(B)
REG_ROW3: J5.2 R168.2 U8.1(A:OUT1) U$2.2(C)
REG_ROW4: J7.2 R186.2 U11.1(A:OUT1) U$2.3(D)
ROW1: Q1.2(S) R5.2 U1.3(A:+IN1)
ROW2: Q2.2(S) R38.2 U4.3(A:+IN1)
ROW3: Q5.2(S) R43.2 U7.3(A:+IN1)
ROW4: Q6.2(S) R48.2 U10.3(A:+IN1)
S/!P!0: U15.25(PC2(ADC2)) U$2.13(SSHIFT/!PLOAD)
S/!P!1: J9.8 U15.26(PC3(ADC3))
S/!P!2: J10.6 U15.10(PD6(AIN0))
S/!P!3: J11.6 U15.11(PD7(AIN1))
SCLK: J11.8 J14.2 PI_GPIO.23 U15.17(PB5(SCK))
SHIFT_CLK: J9.4 U15.19(ADC6) U$2.11(SHIFTCLOCK)
TOP_LED1: J12.1 U15.2(PD4(XCK/T0))
TOP_LED2: J12.8 U15.12(PB0(ICP))
UC_ADC_FB: C10.2 R18.1 R19.2 U15.23(PC0(ADC0))
UC_DATA1: PI_GPIO.11 U15.30(PD0(RXD))
UC_DATA2: PI_GPIO.13 U15.31(PD1(TXD))
UC_PWM_DRIVE: R25.2 U15.9(PD5(T1))
UC_SCL: R203.1 U13.P$1(SCL) U15.28(PC5(ADC5/SCL))
UC_SDA: R202.1 U13.P$8(SDA) U15.27(PC4(ADC4/SDA))
VBIAS [hv]: J9.3 J10.3 J11.3 J13.1 R1.2 R6.2 R40.2 R45.2 R50.2 R55.2 R60.2 R65.2
VBIASPRE [Power]: C1.2 C11.2 D33.- J13.2 R17.2 R20.2
VBUS: D26.+ USB1.1(VCC)
Unconnected: PI_GPIO.1 PI_GPIO.12 PI_GPIO.15 PI_GPIO.16 PI_GPIO.17 PI_GPIO.18 PI_GPIO.22 PI_GPIO.29 PI_GPIO.31 PI_GPIO.32 PI_GPIO.33 PI_GPIO.35 PI_GPIO.36 PI_GPIO.37 PI_GPIO.38 PI_GPIO.40 USB1.2(DM) USB1.3(DP) USB1.4(ID)

### Notes on the sheet
- Arduino
  ATMEL328
  SPI Programmable via Pi
- Opamp Block
  Row amplifier (4 Diodes)
  Column amplifier (4 Diodes)
- External reference injection point
  Or jumper for simple inverter
- Row Input
- ICSP
- Column Input
- Pi Connector, I2C, UART
  headers & E2
- Boost Power Supply
- Jumper for using an exeternal PSU
- Opamp Block
  Row amplifier (4 Diodes)
  Column amplifier (4 Diodes)
- External reference injection point
  Or jumper for simple inverter
- Row Input
- Diode detector module | Diode detector module | Diode detector module | Diode detector module
- Column Input
- Diode detector module | Diode detector module | Diode detector module | Diode detector module
- Opamp Block
  Row amplifier (4 Diodes)
  Column amplifier (4 Diodes)
- External reference injection point
  Or jumper for simple inverter
- Row Input
- Column Input
- Stacking Headers
- ADC readout
- Level 1: Pixel Array | Level 2: Pixel Array | Level 3: Pixel Array | Level 4: Sensor Array
- Baseboard: ADC readout
- Opamp Block
  Row amplifier (4 Diodes)
  Column amplifier (4 Diodes)
- External reference injection point
  Or jumper for simple inverter
- Parallel to serial readout
- Diode prevents Pi Powering Sensor board
- Row Input
- Baseboard: Pixel Array Position Read Out
- USB & Power Supplies
- Column Input
- Shielding modules
- Cosmic Pi uTelescope
- Release: Alpha Version - Untested
  Notes:
  This board was designed during the iSDG summer school 2017.
  It is released under the CERN OHL V1.2 License
  The design files can be found at:
  https://github.com/CosmicPi/uTelescope
  Design by H. Borras and J. Devine

## Sheet 2 of 2

## Library data of the parts
3V3 5V = testpad:TP: Test pad
C1 C13 C15 = Seeed-Capacitor:CERAMIC-100NF-50V-10%-X7R(0603): 302010138; MPN: CC0603KRX7R9BB104
C2 C3 C21-C26 C84-C87 = Seeed-Capacitor:CERAMIC-100UF-6.3V-20%-X5R(1206): 302010183; MPN: GRM31CR60J107ME39L; VALUE: 100uf
C4 C9 C16 C51 C56 C57 C62 C67 C68 C73 C78 C79 = Seeed-Capacitor:CERAMIC-22UF-6.3V-20%-X5R(0805): 302010171; MPN: CC0805MKX5R5BB226
C5 C7 C11 C17 C19 C52 C54 C58 C60 C63 C65 C69 C71 C74 C76 C80 C82 = Seeed-Capacitor:CERAMIC-47PF-50V-5%-NP0(0402): 302010007; MPN: CC0402JRNPO9BN470
C6 C8 C18 C20 C53 C55 C59 C61 C64 C66 C70 C72 C75 C77 C81 C83 = Seeed-Capacitor:CERAMIC-100NF-25V-10%-X7R(0402): 302010024; MPN: CC0402KRX7R8BB104
C10 = Seeed-Capacitor:CERAMIC-1NF-50V-5%-C0G(0603): 302010341; MPN: GRM1885C1H102JA01D
C12 C14 = Seeed-Capacitor:CERAMIC-47NF-25V-10%-X7R(0402): 302010002; MPN: CC0402KRX7R8BB473
C88 C94 = rcl:C-EU: CAPACITOR, European symbol
C89-C92 = Seeed-Capacitor:CERAMIC-22PF-50V-5%-NPO(0603): 302010143; MPN: CC0603JRNPO9BN220
C93 = C:C
C95 = Seeed-Capacitor:TANTALUM-SMD-22UF-10V-10%(AVX-B): 302020021; MPN: TAJB226K010RNJ
C96 = Seeed-Capacitor:CERAMIC-22PF-50V-5%-NPO(0603): 302010143; MPN: CC0603JRNPO9BN220; VALUE: 22pf
D1 D4-D18 D27-D32 D35-D44 = omnivision:VBPW34FAS: VBPW34FASR Series 950 nm ±65° 55 uA (Ira) SMT Silicon Pin Photodiode; AVAILABILITY: Good; DESCRIPTION: VBPW34FASR Series 950 nm %C2%B165%C2%B0 55 uA %28Ira%29 SMT Silicon Pin Photodiode; MF: Vishay; MP: VBPW34FAS; PACKAGE: None; PRICE: 0.58 USD
D2 D3 D19-D24 = Seeed-Diode:SMD-DIODE-100V-200MA(SOD-123): 304010007; MPN: MMSD4148
D25 D26 D33 = Seeed-Diode:SMD-DIODE-SCHOTTKY-28V-5A(DO-214AA): 304020021; MPN: SS54B
D34 = Seeed-LED:SMD-LED-CLEAR-BLUE(0603): 304090045; MPN: 19-217-BHC-ZL1M2RY-3T
F2 = Seeed-OPL-2017-01-Fuse-Akita:307010159_SMD_PPTC_6V_0805: SMD PPTC;6V-1.1A;0805, Littelfuse Inc.;0805L110SLYR, SKU: 307010159
FD1-FD8 = SparkFun-Aesthetics:FIDUCIAL: Fiducial Alignment Points Point-of-reference for pick-and-place machines and other optical instruments.
J1-J8 J13 J15 J18 = Seeed-Connector:DIP-BLACK-MALE-HEADER-VERT(2P-2.54): 320020016; MPN: P125-1102A0BS116A1
J9-J12 = Seeed-Connector:DIP-LONG-BLACK-FEMALE-HEADER-VERT(10P-2.54): 320030039; MPN: F185-1110A1BSYA1
J14 = Seeed-Connector:DIP-YELLOW-MALE-HEADER-VERT(2X3P-2.54): 320020027; MPN: P125-1203A0BS116A2
J16 J17 = Seeed-Connector:DIP-WHITE-MALE-HEADER-VERT(2P-2.54): 320020037; MPN: P125-1102A0BS116A3
L1 L5 = Seeed-OPL-2017-01-Inductor-Akita:303010169_330UH_5X5MM: SPD4D28-331M, SMD Inductor 330uH-±20%-150mA;5.0*5.0*3.2mm, SKU: 303010169
L2 = Seeed-OPL-2017-01-Inductor-Akita:303010098_100UH_0805: TDK Corporation;MLF2012C101M, SMD Inductor;100uH-20%-2mA-0805, SKU: 303010098
L3 = Seeed-Inductor:SMD-INDUCTOR-4.7NH-0.3NH-300MA(0402): 303010037; MPN: LQG15HS4N7S02
LOGO1 = SparkFun-Aesthetics:OSHW-LOGO: Open-Source Hardware (OSHW) Logo This logo indicates the piece of hardware it is found on incorporates a OSHW license and/or adheres to the definition of open source hardware found here: http://freedomdefined.org/OSHW
PI_GPIO = con-lstb:MA20-2: PIN HEADER; OC_FARNELL: unknown; OC_NEWARK: unknown
Q1 Q2 Q5-Q10 = transistor-fet:?548*: N-Channel JFETs Source: VISHAY 2N5484.pdf Compatible: TO92 2N5245 J304 J305 U310 J308 J309 J310 TO72 2N4416 2N4416A 2N3823 2N4351 3N169 3N170 3N171 MFE3002 TO18 2N3796 2N3797 MFE825 Source: Motorola European Master Guide Pacge 3-59
Q3 = 2N7002_215:2N7002,215; AVAILABILITY: Good; DESCRIPTION: 2N7002 Series N-Channel 60 V 5 O 0.83 W TrenchMOS FET - SOT-23-3; MF: NXP Semiconductors; MP: 2N7002,215; PACKAGE: TO-236 NXP Semiconductors; PRICE: 0.07 USD
Q4 = Seeed-Transistor:DIP-MOSFET-N-CH-100V-9.7A-IRF520NPBF(TO-220AB): 305030059; MPN: IRF520NPBF
R1 R6 R40 R45 R50 R55 R60 R65 = Seeed-Resistor:SMD-RES-1M-1%-1/16W(0402): 301010043; MPN: RC0402FR-071ML
R2 R3 R7 R37 R41 R42 R46 R47 R51 R52 R56 R57 R61 R62 R66 R67 = Seeed-Resistor:SMD-RES-10M-1%-1/16W(0402): 301010509; MPN: RC0402FR-0710ML
R4 R39 R44 R49 R54 R59 R64 R69 R197 R198 = Seeed-Resistor:SMD-RES-4.7K-5%-1/16W(0402): 301010010; MPN: RC0402JR-074K7L; VALUE: 4.7K
R5 R38 R43 R48 R53 R58 R63 R68 = Seeed-Resistor:SMD-RES-4.7K-5%-1/16W(0402): 301010010; MPN: RC0402JR-074K7L
R8 R12 R17 R28 R32 R142 R146 R151 R155 R160 R164 R169 R173 R178 R182 R187 R191 = Seeed-Resistor:SMD-RES-200K-5%-1/10W(0603): 301010212; MPN: RC0603JR-07200KL
R9 R13 R29 R33 R143 R147 R152 R156 R161 R165 R170 R174 R179 R183 R188 R192 = Seeed-Resistor:SMD-RES-100K-1%-1/16W(0402): 301010456; MPN: RC0402FR-07100KL
R10 R14 R30 R34 R144 R148 R153 R157 R162 R166 R171 R175 R180 R184 R189 R193 = Seeed-Resistor:SMD-RES-30K-1%-1/10W(0603): 301010202; MPN: RC0603FR-0730KL
R11 R15 R31 R35 R145 R149 R154 R158 R163 R167 R172 R176 R181 R185 R190 R194 = Seeed-Resistor:SMD-RES-10K-1%-1/16W(0402): 301010047; MPN: RC0402FR-0710KL
R16 R36 R150 R159 R168 R177 R186 R195 = Seeed-Resistor:SMD-RES-49.9R-1%-1/16W(0402): 301010041; MPN: RC0402FR-0749R9L
R18 = Seeed-Resistor:SMD-RES-20K-1%-1/10W(0603): 301010288; MPN: RC0603FR-0720KL
R19 = Seeed-Resistor:SMD-RES-2.7K-1%-1/16W(0402): 301010671; MPN: RC0402FR-072K7L
R20 = Seeed-Resistor:SMD-RES-1K-1%-1/10W(0603): 301010298; MPN: RC0603FR-071KL
R21 R22 = Seeed-Resistor:SMD-RES-3.6R-5%-1/10W(0603): 301010140; MPN: RC0603JR-073R6L
R23 = Seeed-Resistor:SMD-RES-4.7K-5%-1/8W(0805): 301010306; MPN: RC0805JR-074K7L
R24 R25 = Seeed-Resistor:SMD-RES-10R-1%-1/10W(0603): 301010185; MPN: RC0603FR-0710RL
R26 R27 = Seeed-Resistor:SMD-RES-10K-1%-1/10W(0603): 301010299; MPN: RC0603FR-0710KL
R196 R200-R203 = Seeed-Resistor:SMD-RES-10K-1%-1/10W(0603): 301010299; MPN: RC0603FR-0710KL; VALUE: 10K
R199 = resistor:R-EU_: RESISTOR, European symbol
U1-U12 = Seeed-IC:AMPLIFIER-LM358DR(SOIC8): 310020021; MPN: LM358DR
U13 = Seeed-OPL-2017-01-IC-Akita:310990001_ADC121C021CIMM: TI;ADC121C021CIMM/NOPB, SMD 12-Bit Analog-to-Digital, SKU: 310990001
U14 = Seeed-OPL-2017-01-IC-Akita:310090051_24LC32AT-I/OT: Microchip;24LC32AT-I/OT, SMD IC Memory;SOT-23-5, SKU: 310090051
U15 = Seeed-IC:MCU-ATMEGA328P-AU(TQFP32): 310010049; MPN: ATMEGA328P-AU
U16 = Seeed-IC:PMIC-CJT1117-3.3(SOT223): 310030097; MPN: CJT1117-3.3
U$1 = DIOM8059X265N:CD214A-F1200
U$2 = SOIC127P600X175-16N:MC74HC589A
U$3 U$4 = omnivision:WURTH36103305
USB1 = Seeed-Connector:MICRO-USB-SMD-B-(10118193-0001LF): 320010003; MPN: 10118193-0001LF
X1 = Seeed-OPL-2017-01-Crystal-Akita:306010054_XTAL_16MHZ-5032_2P: SMD Crystal 16MHz-8pF-20ppm-40R;2P-L5.0*W3.2mm, SKU: 306010054

## Net classes
0 default: width 0.152 mm, clearance 0.152 mm
1 Power: width 0.152 mm, clearance 0.152 mm
2 hv: width 0.152 mm, clearance 0.152 mm
3 PowerGND: width 0.152 mm, clearance 0.152 mm